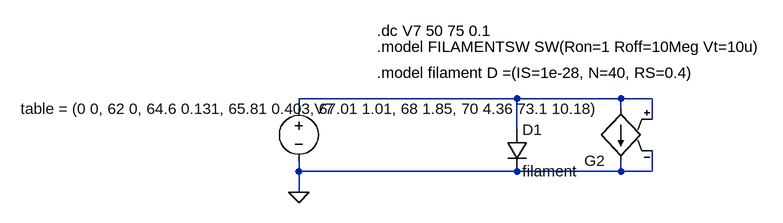
[diagram p0: schematic filament_part.asc]
filament_part.asc, the LTspice schematic file:
Version 4
SHEET 1 880 680
WIRE -256 -144 -592 -144
WIRE -96 -144 -256 -144
WIRE -48 -144 -96 -144
WIRE -592 -128 -592 -144
WIRE -96 -128 -96 -144
WIRE -48 -112 -48 -144
WIRE -256 -96 -256 -144
WIRE -592 -32 -592 -48
WIRE -256 -32 -592 -32
WIRE -96 -32 -96 -48
WIRE -96 -32 -256 -32
WIRE -48 -32 -48 -64
WIRE -48 -32 -96 -32
WIRE -592 0 -592 -32
FLAG -592 0 0
SYMBOL voltage -592 -144 R0
WINDOW 3 24 44 Left 2
WINDOW 123 0 0 Left 0
WINDOW 39 0 0 Left 0
SYMATTR InstName V7
SYMATTR Value ""
SYMBOL diode -272 -96 R0
SYMATTR InstName D1
SYMATTR Value filament
SYMBOL g2 -96 -32 R180
SYMATTR InstName G2
SYMATTR Value table = (0 0, 62 0, 64.6 0.131, 65.81 0.403, 67.01 1.01, 68 1.85, 70 4.36 73.1 10.18)
TEXT -472 -248 Left 2 !.dc V7 50 75 0.1
TEXT -472 -224 Left 2 !.model FILAMENTSW SW(Ron=1 Roff=10Meg Vt=10u)
TEXT -472 -184 Left 2 !.model filament D =(IS=1e-28, N=40, RS=0.4)

The netlist it stands for:
* filament_part.asc
V7 N001 0
D1 N001 0 filament
G2 N001 0 N001 0 table = (0 0, 62 0, 64.6 0.131, 65.81 0.403, 67.01 1.01, 68 1.85, 70 4.36 73.1 10.18)
.model D D
.lib standard.dio
.dc V7 50 75 0.1
.model FILAMENTSW SW(Ron=1 Roff=10Meg Vt=10u)
.model filament D =(IS=1e-28, N=40, RS=0.4)
.backanno
.end